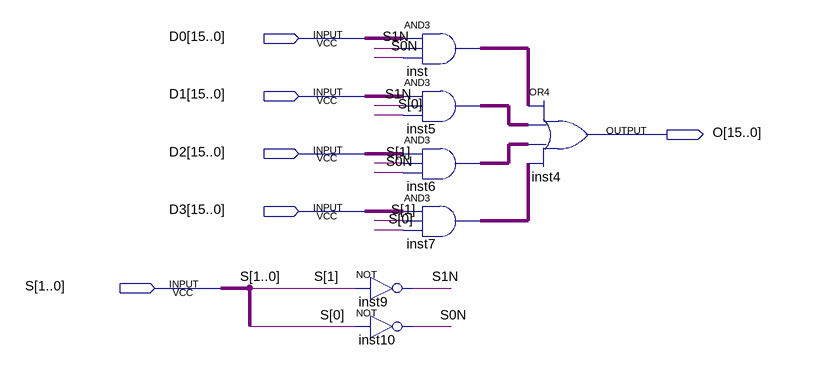
[diagram p0: schematic sheet]
// Quartus schematic 16MUX41.bdf as structural Verilog: 7 symbols, 6 pins
module \16MUX41  (
  input  [15:0] D0,
  input  [15:0] D1,
  input  [15:0] D2,
  input  [15:0] D3,
  input  [1:0] S,
  output [15:0] O
);

  wire S0N, S1N;
  wire [15:0] inst5_out, inst6_out, inst7_out, inst_out;

  not inst9 (S1N, S[1]);
  not inst10 (S0N, S[0]);
  assign inst_out = D0 & {16{S1N}} & {16{S0N}};  // AND3 inst, 16 bits wide
  assign inst5_out = D1 & {16{S1N}} & {16{S[0]}};  // AND3 inst5, 16 bits wide
  assign inst6_out = D2 & {16{S[1]}} & {16{S0N}};  // AND3 inst6, 16 bits wide
  assign inst7_out = D3 & {16{S[1]}} & {16{S[0]}};  // AND3 inst7, 16 bits wide
  assign O = inst_out | inst5_out | inst6_out | inst7_out;  // OR4 inst4, 16 bits wide
endmodule
